# Altium schematic sheet SSL-Motherboard.SchDoc
size A4
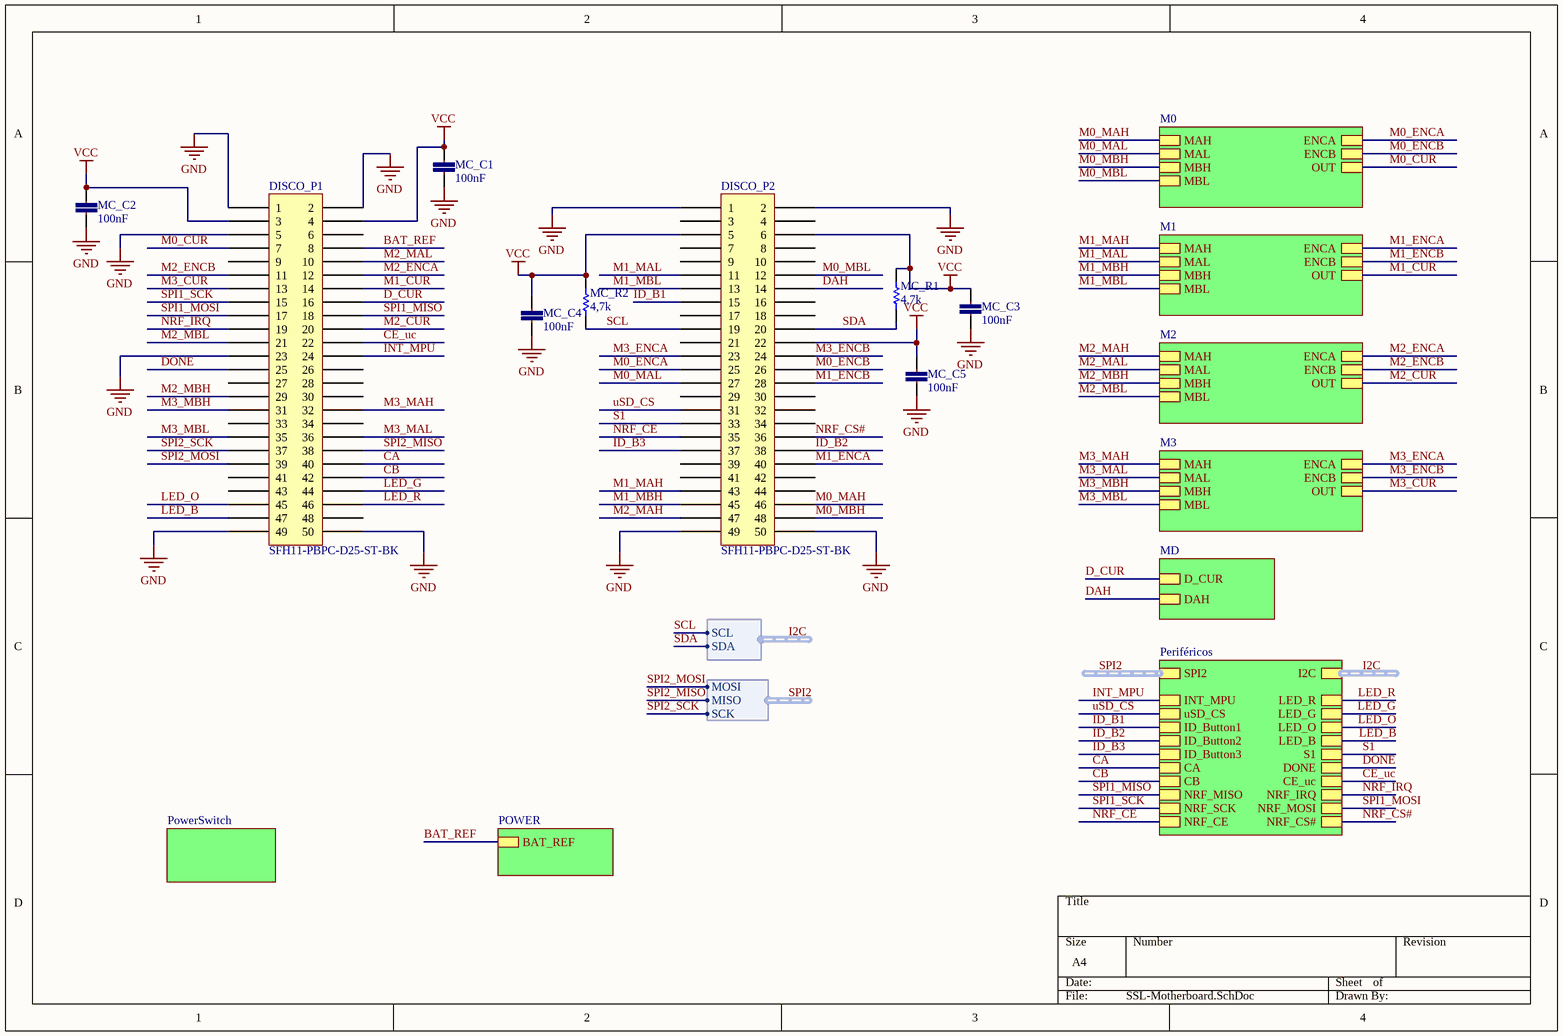
[diagram p0: SSL-Motherboard.SchDoc]

## Parts
DISCO_P1  SFH11-PBPC-D25-ST-BK  [25x02_Conector_Female]
DISCO_P2  SFH11-PBPC-D25-ST-BK  [25x02_Conector_Female]
MC_C1  100nF  [0402-CAP]
MC_C2  100nF  [0402-CAP]
MC_C3  100nF  [0402-CAP]
MC_C4  100nF  [0402-CAP]
MC_C5  100nF  [0402-CAP]
MC_R1  4,7k  [0402]
MC_R2  4,7k  [0402]

## Sub-sheets
M0 = Motors.SchDoc: MBH, MAH, MBL, MAL, ENCA, ENCB, OUT
M1 = Motors.SchDoc: MBH, MAH, MBL, MAL, ENCA, ENCB, OUT
M2 = Motors.SchDoc: MBH, MAH, MBL, MAL, ENCA, ENCB, OUT
M3 = Motors.SchDoc: MBH, MAH, MBL, MAL, ENCA, ENCB, OUT
MD = Dribble.SchDoc: D_CUR, DAH
Periféricos = Peripherals.SchDoc: INT_MPU, uSD_CS, LED_R, LED_G, LED_O, LED_B, ID_Button1, SPI2 (harness SPI), I2C (harness I2C), S1, CA, CB, CE_uc, NRF_MISO, NRF_SCK, NRF_CE, NRF_IRQ, NRF_MOSI, NRF_CS#, ID_Button2, ID_Button3, DONE
POWER = PowerSupply.SchDoc: BAT_REF
PowerSwitch = PowerSwitch.SchDoc: no entries

## Harnesses
I2C: SCL, SDA
SPI: MOSI, MISO, SCK

## Nets
GND: DISCO_P1.1 DISCO_P1.2 DISCO_P1.5 DISCO_P1.23 DISCO_P1.49 DISCO_P1.50 DISCO_P2.1 DISCO_P2.2 DISCO_P2.49 DISCO_P2.50 MC_C1.1 MC_C2.2 MC_C3.1 MC_C4.1 MC_C5.1
VCC: DISCO_P1.3 DISCO_P1.4 DISCO_P2.5 DISCO_P2.6 DISCO_P2.22 MC_C1.2 MC_C2.1 MC_C3.2 MC_C4.2 MC_C5.2 MC_R1.2 MC_R2.2
BAT_REF: DISCO_P1.8 ; sheet POWER/BAT_REF
CA: DISCO_P1.40 ; sheet Periféricos/CA
CB: DISCO_P1.42 ; sheet Periféricos/CB
CE_uc: DISCO_P1.22 ; sheet Periféricos/CE_uc
D_CUR: DISCO_P1.16 ; sheet MD/D_CUR
DAH: DISCO_P2.14 ; sheet MD/DAH
DONE: DISCO_P1.25 ; sheet Periféricos/DONE
ID_B1: DISCO_P2.15 ; sheet Periféricos/ID_Button1
ID_B2: DISCO_P2.38 ; sheet Periféricos/ID_Button2
ID_B3: DISCO_P2.37 ; sheet Periféricos/ID_Button3
INT_MPU: DISCO_P1.24 ; sheet Periféricos/INT_MPU
LED_B: DISCO_P1.47 ; sheet Periféricos/LED_B
LED_G: DISCO_P1.44 ; sheet Periféricos/LED_G
LED_O: DISCO_P1.45 ; sheet Periféricos/LED_O
LED_R: DISCO_P1.46 ; sheet Periféricos/LED_R
M0_CUR: DISCO_P1.7 ; sheet M0/OUT
M0_ENCA: DISCO_P2.25 ; sheet M0/ENCA
M0_ENCB: DISCO_P2.26 ; sheet M0/ENCB
M0_MAH: DISCO_P2.46 ; sheet M0/MAH
M0_MAL: DISCO_P2.27 ; sheet M0/MAL
M0_MBH: DISCO_P2.48 ; sheet M0/MBH
M0_MBL: DISCO_P2.12 ; sheet M0/MBL
M1_CUR: DISCO_P1.14 ; sheet M1/OUT
M1_ENCA: DISCO_P2.40 ; sheet M1/ENCA
M1_ENCB: DISCO_P2.28 ; sheet M1/ENCB
M1_MAH: DISCO_P2.43 ; sheet M1/MAH
M1_MAL: DISCO_P2.11 ; sheet M1/MAL
M1_MBH: DISCO_P2.45 ; sheet M1/MBH
M1_MBL: DISCO_P2.13 ; sheet M1/MBL
M2_CUR: DISCO_P1.20 ; sheet M2/OUT
M2_ENCA: DISCO_P1.12 ; sheet M2/ENCA
M2_ENCB: DISCO_P1.11 ; sheet M2/ENCB
M2_MAH: DISCO_P2.47 ; sheet M2/MAH
M2_MAL: DISCO_P1.10 ; sheet M2/MAL
M2_MBH: DISCO_P1.29 ; sheet M2/MBH
M2_MBL: DISCO_P1.21 ; sheet M2/MBL
M3_CUR: DISCO_P1.13 ; sheet M3/OUT
M3_ENCA: DISCO_P2.23 ; sheet M3/ENCA
M3_ENCB: DISCO_P2.24 ; sheet M3/ENCB
M3_MAH: DISCO_P1.32 ; sheet M3/MAH
M3_MAL: DISCO_P1.36 ; sheet M3/MAL
M3_MBH: DISCO_P1.31 ; sheet M3/MBH
M3_MBL: DISCO_P1.35 ; sheet M3/MBL
NRF_CE: DISCO_P2.35 ; sheet Periféricos/NRF_CE
NRF_CS#: DISCO_P2.36 ; sheet Periféricos/NRF_CS#
NRF_IRQ: DISCO_P1.19 ; sheet Periféricos/NRF_IRQ
S1: DISCO_P2.33 ; sheet Periféricos/S1
SCL: DISCO_P2.19 MC_R2.1 ; sheet Periféricos/I2C.SCL  [project net I2C.SCL]
SDA: DISCO_P2.20 MC_R1.1 ; sheet Periféricos/I2C.SDA  [project net I2C.SDA]
SPI1_MISO: DISCO_P1.18 ; sheet Periféricos/NRF_MISO
SPI1_MOSI: DISCO_P1.17 ; sheet Periféricos/NRF_MOSI
SPI1_SCK: DISCO_P1.15 ; sheet Periféricos/NRF_SCK
SPI2_MISO: DISCO_P1.38 ; sheet Periféricos/SPI2.MISO  [project net SPI2.MISO]
SPI2_MOSI: DISCO_P1.39 ; sheet Periféricos/SPI2.MOSI  [project net SPI2.MOSI]
SPI2_SCK: DISCO_P1.37 ; sheet Periféricos/SPI2.SCK  [project net SPI2.SCK]
uSD_CS: DISCO_P2.31 ; sheet Periféricos/uSD_CS

Not connected (* = marked no-connect by the designer): DISCO_P1 6 9 26 27 28 30 33 34 41 43 48; DISCO_P2 3 4 7 8 9 10 16 17 18 21 29 30 32 34 39 41 42 44

## Buses and harness runs
harness I2C = sheet Periféricos/I2C
harness SPI2 = sheet Periféricos/SPI2

## Library data of the parts
DISCO_P1 DISCO_P2 = 25x02_Conector_Female: 50 Position Header Connector 0.100" (2.54mm) Through Hole Gold
MC_C1-MC_C5 = CC0402-100nF-A.12: CAP CER 0.1UF 10V 20% X5R 0402; Part No: VJ0402V104ZXQPBC; Cod EMS: 05.281.006.133; Value: 100n
MC_R1 MC_R2 = Res1: Resistor; Published: 8-Jun-2000; LatestRevisionDate: 17-Jul-2002; LatestRevisionNote: Re-released for DXP Platform.; PackageReference: AXIAL-0.3; Publisher: Altium Limited; PackageDescription: Axial Device, Thru-Hole; 2 Leads; 0.3 in Pin Spacing; Value: 4,7K